# Altium schematic sheet USB to UART0 interface.SchDoc
size A3; SheetNumber: 2; SheetTotal: 9
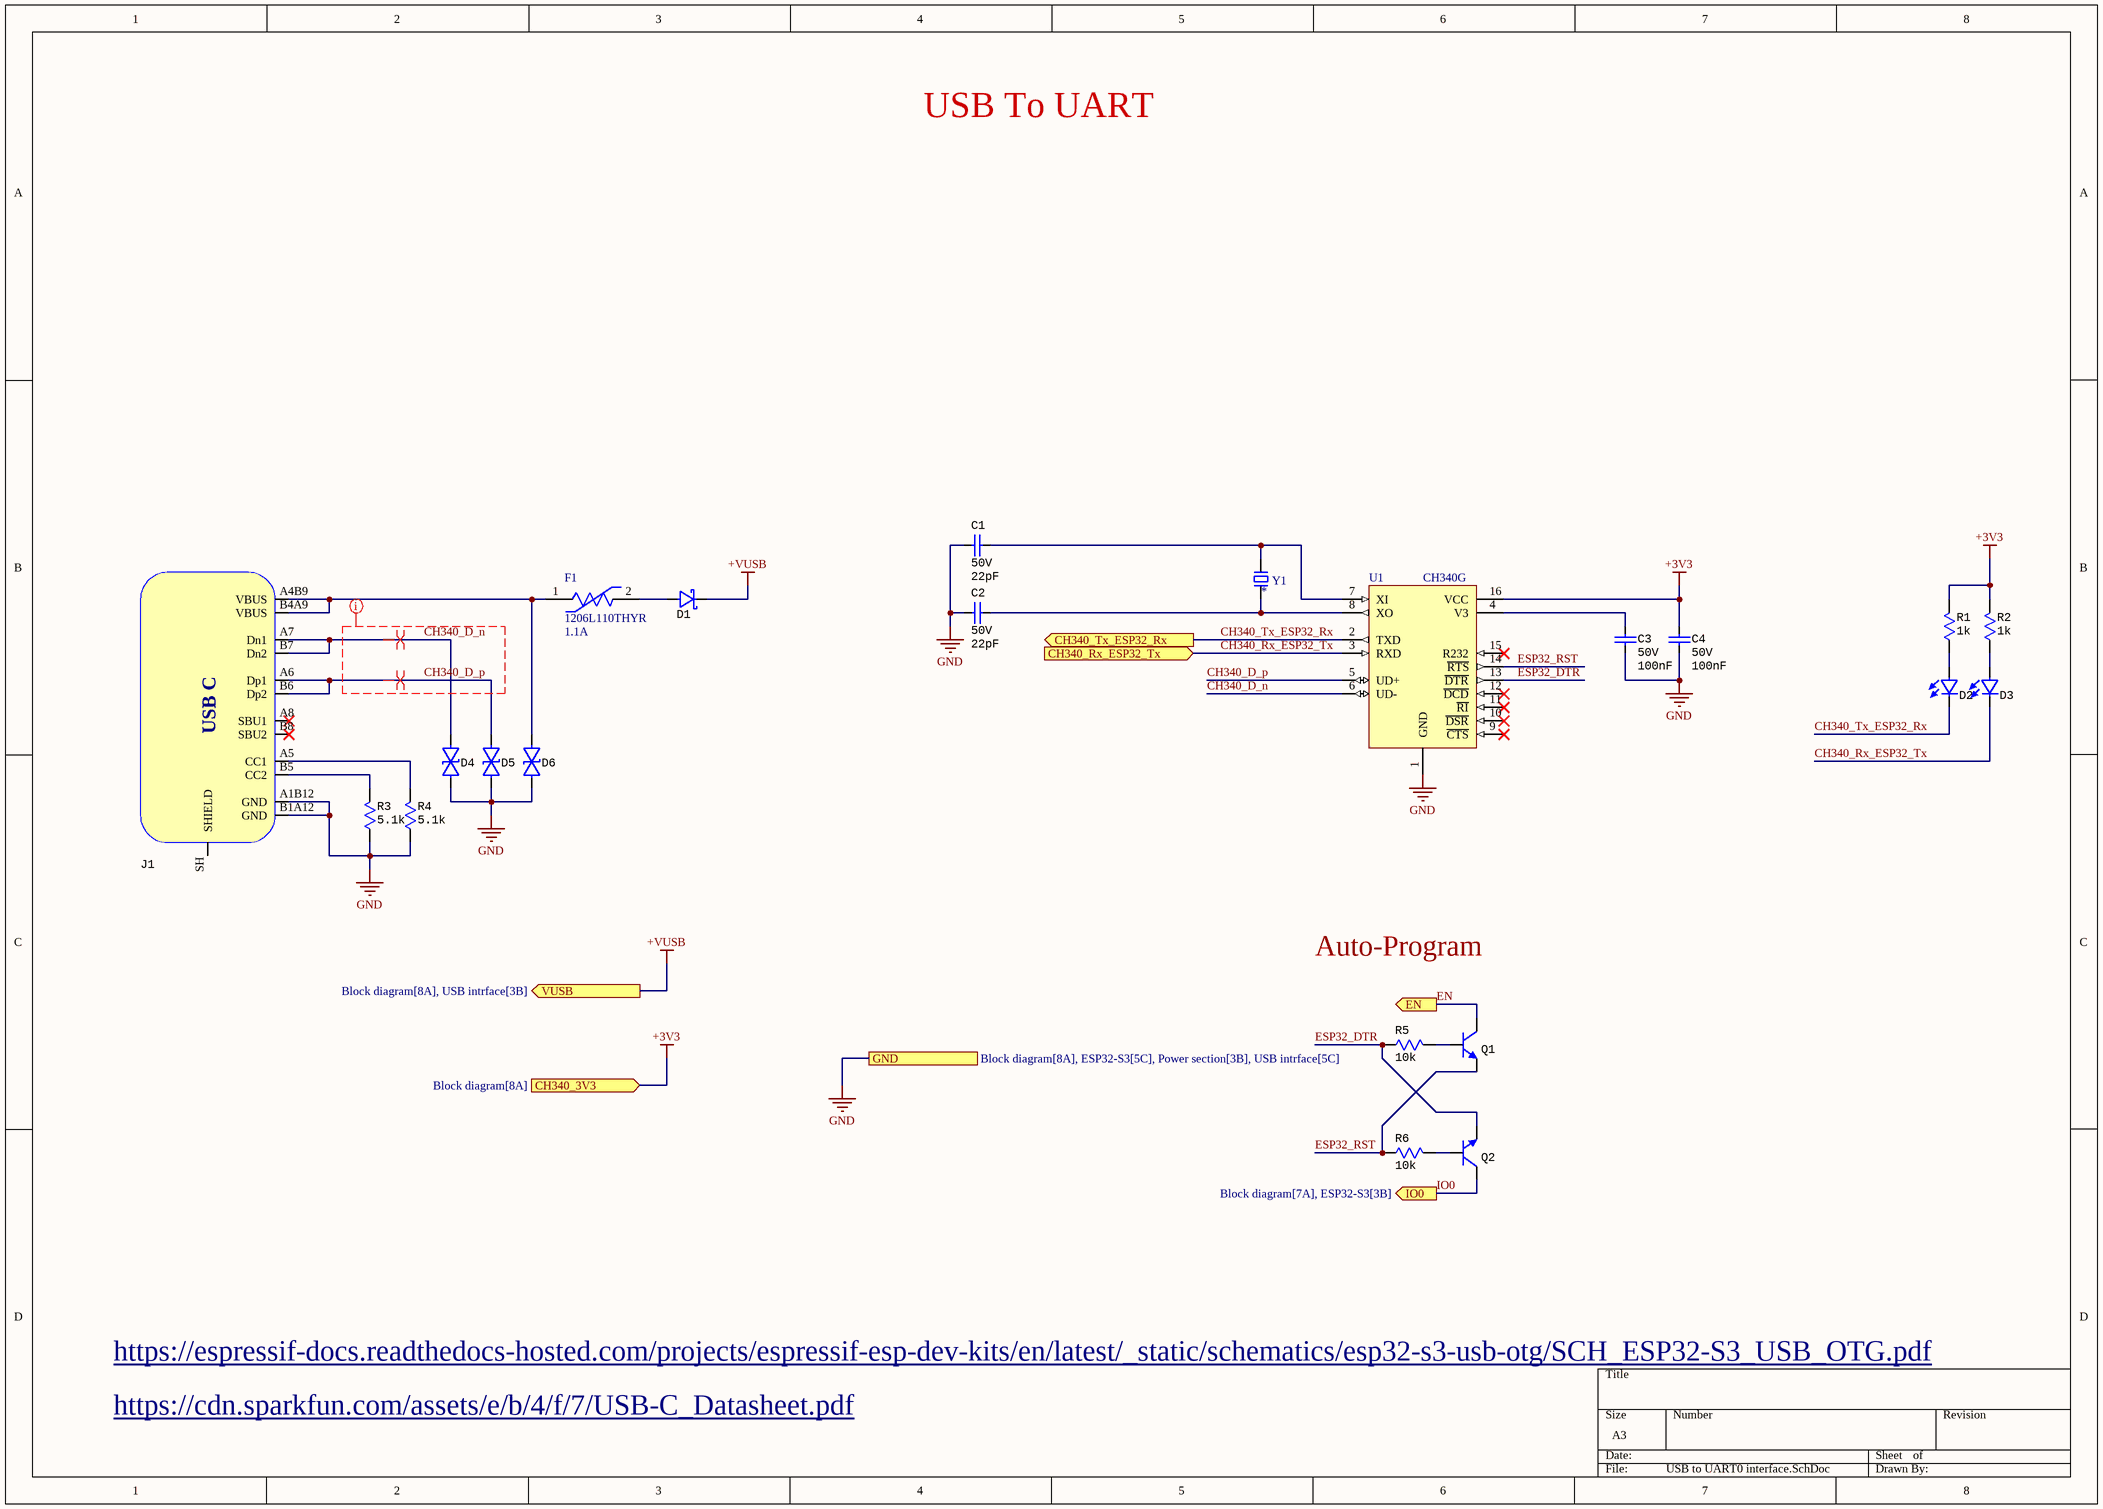
[diagram p0: USB to UART0 interface.SchDoc]

## Parts
C1  Voltage: 50V  [CAP Ceramic SMD 0603]  (hidden comment: 22pF)
C2  Voltage: 50V  [CAP Ceramic SMD 0603]  (hidden comment: 22pF)
C3  Voltage: 50V  [CAP Ceramic SMD 0603]  (hidden comment: 100nF)
C4  Voltage: 50V  [CAP Ceramic SMD 0603]  (hidden comment: 100nF)
D1  (no value)  [Diode Single SMD SOD123]
D2  (no value)  [LED SMD 0805G]
D3  (no value)  [LED SMD 0805G]
D4  (no value)  [Diode Single SMD SOD523]
D5  (no value)  [Diode Single SMD SOD523]
D6  (no value)  [Diode Single SMD SOD523]
F1  1206L110THYR  Hold Current: 1.1A  [FUSE-1206]
J1  Connector_USB_Type_C_12Pin  [USB-C-31-M-12 (12PIN)]  (value not drawn)
Q1  (no value)  [SOT23]
Q2  (no value)  [SOT23]
R1  value 1k  [RES SMD 0603]  (hidden comment: 1kR)
R2  value 1k  [RES SMD 0603]  (hidden comment: 1kR)
R3  value 5.1k  [RES SMD 0603]  (hidden comment: 5.1kR)
R4  value 5.1k  [RES SMD 0603]  (hidden comment: 5.1kR)
R5  value 10k  [RES SMD 0603]  (hidden comment: 10kR)
R6  value 10k  [RES SMD 0603]  (hidden comment: 10kR)
U1  CH340G  [CH340G]
Y1  X49SD8MSD2SC  [Crystal TH 2-PIN HC-49S]  (value not drawn)

## Ports
CH340_3V3 (in, see Block diagram[8A]), CH340_Rx_ESP32_Tx (in, see Block diagram[7A], ESP32-S3[3B]), CH340_Tx_ESP32_Rx (out, see Block diagram[7A], ESP32-S3[3A]), EN (out, see Block diagram[7A], ESP32-S3[3A]), GND (see Block diagram[8A], ESP32-S3[5C], Power section[3B], USB intrface[5C]), IO0 (out, see Block diagram[7A], ESP32-S3[3B]), VUSB (out, see Block diagram[8A], USB intrface[3B])

## Nets
+3V3: C4.1 R1.2 R2.2 U1.16(VCC) ; port CH340_3V3
+VUSB: D1.2 ; port VUSB
GND: C1.1 C2.2 C3.2 C4.2 D4.1 D5.1 D6.1 J1.A1B12(GND) J1.B1A12(GND) R3.1 R4.1 U1.1(GND) ; port GND
CH340_D_n: D4.2 J1.A7(Dn1) J1.B7(Dn2) U1.6(UD-)
CH340_D_p: D5.2 J1.A6(Dp1) J1.B6(Dp2) U1.5(UD+)
CH340_Rx_ESP32_Tx: D3.2 U1.3(RXD) ; port CH340_Rx_ESP32_Tx
CH340_Tx_ESP32_Rx: D2.2 U1.2(TXD) ; port CH340_Tx_ESP32_Rx
EN: Q1.3(C) ; port EN
ESP32_DTR: Q2.2(E) R5.1 U1.13(~{DTR})
ESP32_RST: Q1.2(E) R6.1 U1.14(~{RTS})
IO0: Q2.3(C) ; port IO0
NetC1_2: C1.2 U1.7(XI) Y1.1
NetC2_1: C2.1 U1.8(XO) Y1.2
NetC3_1: C3.1 U1.4(V3)
NetD1_1: D1.1 F1.2
NetD2_1: D2.1 R1.1
NetD3_1: D3.1 R2.1
NetD6_2: D6.2 F1.1 J1.A4B9(VBUS) J1.B4A9(VBUS)
NetJ1_A5: J1.A5(CC1) R4.2
NetJ1_B5: J1.B5(CC2) R3.2
NetQ1_1: Q1.1(B) R5.2
NetQ2_1: Q2.1(B) R6.2

Not connected (* = marked no-connect by the designer): J1 A8(SBU1)* B8(SBU2)* SH(SHIELD); U1 9(~{CTS})* 10(~{DSR})* 11(~{RI})* 12(~{DCD})* 15(R232)*

## Layout directives
net class Diff90Ohm: CH340_D_n, CH340_D_p
differential pair: CH340_D_n, CH340_D_p

## Notes on the sheet
- USB To UART
- Auto-Program
- https://espressif-docs.readthedocs-hosted.com/projects/espressif-esp-dev-kits/en/latest/_static/schematics/esp32-s3-usb-otg/SCH_ESP32-S3_USB_OTG.pdf
- https://cdn.sparkfun.com/assets/e/b/4/f/7/USB-C_Datasheet.pdf
- (in symbol Connector_USB_Type_C_12Pin) USB C

## Library data of the parts
C1 C2 = CAP 0603 22pF 50V: CAP CER 22PF 50V C0G/NP0 0603; Manufacturer: Samsung; Manufacturer Part Number: CL10C220JB81PNC; Tolerance: 5%; Dielectric: C0G; Temperature Coefficient: 300ppm/°C; ComponentLink1URL: https://datasheet.ciiva.com/6293/tdkmlcccaprange-6293701.pdf?src-supplier=Digi-Key; ComponentLink1Description: https://datasheet.ciiva.com/6293/tdkmlcccaprange-6293701.pdf?src-supplier=Digi-Key; ComponentLink2URL: https://datasheet.ciiva.com/22694/1796654-22694102.pdf?src-supplier=Element14; ComponentLink2Description: https://datasheet.ciiva.com/22694/1796654-22694102.pdf?src-supplier=Element14; ComponentLink3URL: https://datasheet.ciiva.com/6293/tdkmlcccaprange-6293704.pdf?src-supplier=Digi-Key; ComponentLink3Description: https://datasheet.ciiva.com/6293/tdkmlcccaprange-6293704.pdf?src-supplier=Digi-Key; ComponentLink4URL: https://datasheet.ciiva.com/28576/1744655-28576921.pdf?src-supplier=Element14; ComponentLink4Description: https://datasheet.ciiva.com/28576/1744655-28576921.pdf?src-supplier=Element14; ComponentLink5URL: https://datasheet.ciiva.com/7975/1796654-7975034.pdf?src-supplier=Element14; ComponentLink5Description: https://datasheet.ciiva.com/7975/1796654-7975034.pdf?src-supplier=Element14; ComponentLink6URL: https://datasheet.ciiva.com/26946/getdatasheetpartid-741952-26946507.pdf?src-supplier=Verical; ComponentLink6Description: https://datasheet.ciiva.com/26946/getdatasheetpartid-741952-26946507.pdf?src-supplier=Verical; ComponentLink7URL: https://datasheet.ciiva.com/6293/tdkmlcccaprange-6293708.pdf?src-supplier=Digi-Key; ComponentLink7Description: https://datasheet.ciiva.com/6293/tdkmlcccaprange-6293708.pdf?src-supplier=Digi-Key; ComponentLink8URL: https://datasheet.ciiva.com/16395/cl10c220jb81pnc-16395896.pdf?src-supplier=Future+Electronics; ComponentLink8Description: https://datasheet.ciiva.com/16395/cl10c220jb81pnc-16395896.pdf?src-supplier=Future+Electronics; ComponentLink9URL: https://datasheet.ciiva.com/15195/getdatasheetpartid-500209-15195809.pdf?src-supplier=Verical; ComponentLink9Description: https://datasheet.ciiva.com/15195/getdatasheetpartid-500209-15195809.pdf?src-supplier=Verical; Supplier 1: LCSC; RoHS: Yes; Category: Ceramic Capacitors; Stock 1: 8800; Pricing 1: 50=0.02060, 500=0.01690, 1500=0.01410, 5000=0.01190, 25000=0.01150, 50000=0.01130 (USD); Mount: Surface Mount; Case/Package: 0603; Case Code (Metric): 1608; Case Code (Imperial): 0603; Min Operating Temperature: -55°C; Max Operating Temperature: 125°C; Package Quantity: 1; Packaging: Tape and Reel; Capacitance: 22pF; Voltage Rating: 50V; Series: CL; Length: 1.6mm; Width: 0.031inch; Height: 0.8mm; Depth: 0.8mm; Thickness: 0.035inch; Ratings: AEC-Q200; Radiation Hardening: No; RoHS Compliant: Yes; Lead Free: Lead Free; Supplier Part Number 1: C170132; Supplier 2: LCSC; Supplier Part Number 2: C1653; Value: 22pF
C3 C4 = CAP 0603 100nF 50V: Multilayer Ceramic Capacitors MLCC Surface Mount 0603 0.1uF 50 Volts X7R 10%; Manufacturer: Murata; Manufacturer Part Number: GRM188R71H104KA93D; Insulation Resistance: 10GR; Supplier 1: LCSC; RoHS: Yes; Category: Ceramic Capacitors; Stock 1: 3546650; Pricing 1: 50=0.00420, 500=0.00330, 1500=0.00290, 5000=0.00260, 25000=0.00250, 50000=0.00240 (USD); Mount: Surface Mount; Case/Package: 0603; Number of Pins: 2; Case Code (Imperial): 0603; Case Code (Metric): 1608; Dielectric Material: Ceramic; Material: Ceramic; Contact Plating: Tin,Matte; Min Operating Temperature: -55°C; Max Operating Temperature: 125°C; Capacitance: 100nF; Tolerance: 10%; Packaging: Tape and Reel; Dielectric: X7R; Voltage Rating (DC): 50V; Termination: SMD/SMT; Package Quantity: 1; Voltage Rating: 50V; Length: 1.6mm; Width: 0.8mm; Height: 0.8mm; Depth: 0.8mm; Thickness: 0.035inch; Radiation Hardening: No; RoHS Compliant: Yes; REACH SVHC: No SVHC; Lead Free: Lead Free; ComponentLink1URL: https://datasheet.ciiva.com/19467/1857604-19467681.pdf?src-supplier=Jameco; ComponentLink1Description: https://datasheet.ciiva.com/19467/1857604-19467681.pdf?src-supplier=Jameco; ComponentLink2URL: https://datasheet.ciiva.com/11786/0900766b807a1cab-11786047.pdf?src-supplier=RSComponents; ComponentLink2Description: https://datasheet.ciiva.com/11786/0900766b807a1cab-11786047.pdf?src-supplier=RSComponents; ComponentLink3URL: https://datasheet.ciiva.com/29201/451744-da-01-en-vs-kondensator-0603-29201904.pdf?src-supplier=Conrad; ComponentLink3Description: https://datasheet.ciiva.com/29201/451744-da-01-en-vs-kondensator-0603-29201904.pdf?src-supplier=Conrad; ComponentLink4URL: https://datasheet.ciiva.com/7937/4360-7937659.pdf?src-supplier=Element14; ComponentLink4Description: https://datasheet.ciiva.com/7937/4360-7937659.pdf?src-supplier=Element14; ComponentLink5URL: https://datasheet.ciiva.com/14116/nmgrm-data-en-14116602.pdf?src-supplier=Distrelec; ComponentLink5Description: https://datasheet.ciiva.com/14116/nmgrm-data-en-14116602.pdf?src-supplier=Distrelec; ComponentLink6URL: https://datasheet.ciiva.com/48436/nmgrm-data-en-48436667.pdf?src-supplier=Distrelec; ComponentLink6Description: https://datasheet.ciiva.com/48436/nmgrm-data-en-48436667.pdf?src-supplier=Distrelec; ComponentLink7URL: https://datasheet.ciiva.com/28534/4360-28534245.pdf?src-supplier=Element14; ComponentLink7Description: https://datasheet.ciiva.com/28534/4360-28534245.pdf?src-supplier=Element14; ComponentLink8URL: https://datasheet.ciiva.com/131/partnumbering-e-01-131739.pdf?src-supplier=Digi-Key; ComponentLink8Description: https://datasheet.ciiva.com/131/partnumbering-e-01-131739.pdf?src-supplier=Digi-Key; ComponentLink9URL: https://datasheet.ciiva.com/131/partnumbering-e-01-131738.pdf?src-supplier=Digi-Key; ComponentLink9Description: https://datasheet.ciiva.com/131/partnumbering-e-01-131738.pdf?src-supplier=Digi-Key; ComponentLink10URL: https://datasheet.ciiva.com/131/partnumbering-e-01-131740.pdf?src-supplier=Digi-Key; ComponentLink10Description: https://datasheet.ciiva.com/131/partnumbering-e-01-131740.pdf?src-supplier=Digi-Key; ComponentLink11URL: https://datasheet.ciiva.com/7937/1747470-7937658.pdf?src-supplier=Element14; ComponentLink11Description: https://datasheet.ciiva.com/7937/1747470-7937658.pdf?src-supplier=Element14; Supplier Part Number 1: C77055; Value: 100nF
D1 = B5819W: 40V 600mV@1A 1A SOD-123 Schottky Barrier Diodes (SBD) ROHS; Manufacturer: MCC; Manufacturer Part Number: B5819W-TP; Element Configuration: Single; Forward Voltage: 550mV; Max Reverse Voltage (DC): 20V; Max Forward Surge Current (Ifsm): 10A; Max Reverse Current: 1mA; Max Power Dissipation: 250mW; Supplier 1: LCSC; RoHS: Yes; Category: Rectifier Diodes; Stock 1: 8570; Pricing 1: 10=0.04150, 100=0.03440, 300=0.03090, 3000=0.02820, 6000=0.02610, 9000=0.02500 (USD); Mount: Surface Mount; Min Operating Temperature: -65°C; Max Operating Temperature: 125°C; Package Quantity: 3000; Packaging: Tape and Reel; Average Rectified Current: 1A; Series: -; Reverse Voltage (DC): 40V; Forward Current: 1A; Max Repetitive Reverse Voltage (Vrrm): 40V; RoHS Compliant: Yes; ComponentLink1URL: https://datasheet.ciiva.com/6378/b5817w-b5819wsod-123-6378255.pdf?src-supplier=Digi-Key; ComponentLink1Description: https://datasheet.ciiva.com/6378/b5817w-b5819wsod-123-6378255.pdf?src-supplier=Digi-Key; Supplier Part Number 1: C84354
D2 D3 = LED 0805 Emerald: Manufacturer: FOSHAN Nationstar Optoelectronics; Manufacturer Part Number: NCD0805G1; Supplier 1: LCSC; Supplier Part Number 1: C84260; RoHS: No; Category: Uncategorized; Stock 1: 432460; Pricing 1: 20=0.01910, 200=0.01510, 600=0.01290, 3000=0.01160, 9000=0.01050, 21000=0.00990 (USD)
D4-D6 = LESD5D5.0CT1G: Bi-Directional 9.4A 5V 18.6V 5.6V SOD-523 ESD Protection Devices ROHS; Manufacturer: UMW(Youtai Semiconductor); Supplier 1: LCSC; Manufacturer Part Number: LESD5D5.0CT1G; RoHS: No; Category: Uncategorized; Stock 1: 13940; Pricing 1: 20=0.02140, 200=0.01710, 600=0.01470, 3000=0.01330, 9000=0.01330, 21000=0.01330 (USD); Supplier Part Number 1: C5199850
F1 = 1206L110THYR: PTC RESET FUSE 8V 1.1A 1206; Manufacturer: Littelfuse; Trip Time: 0.1s; Trip Current: 2.2A; Value: 0.04-0.21Ω; Current Rating: 100A; Voltage Rating: 8V; Device Class L3: unset; Manufacturer Part Number: 1206L110THYR; ComponentLink2URL: https://m.littelfuse.com/~/media/electronics/datasheets/resettable_ptcs/littelfuse_ptc_1206l_datasheet.pdf.pdf; Height: 0.6mm; Temperature Range Low: -40°C; Automotive: No; Device Class L2: PTC Resettable Fuses; Device Class L1: Circuit Protection; Digikey Description: PTC RESET FUSE 8V 1.1A 1206; Octopart: https://octopart.com/1206l110thyr-littelfuse-11800142; Temperature Range High: +85°C; Category: Fuse; RoHS: TRUE; Ambient Temperature Range Low: -40°C; Mouser Description: Resettable Fuses - PPTC PTC 8V 1206 1.1A POLYFUSE SMD THIN; ComponentLink2Description: Datasheet; Ambient Temperature Range High: +85°C; Lead Free: Yes; Resistance: 0.04-0.21Ω; Temperature: -40°C to +85°C; Package: 1206L
J1 = Connector_USB_Type_C_12Pin: Korean Hroparts Elec / USB-Type-C / Num of contacts 16 / Surface Mount; ManufacturerPartNumber: TYPE-C-31-M-12; SuplierPartNumber: C165948; TypeConnector: USB Type C; CurrentMax: 3A; Manufacturer: Korean Hroparts; HelpURL: https://lcsc.com/product-detail/USB-Type-C_Korean-Hroparts-Elec-TYPE-C-31-M-12_C165948.html
Q1 Q2 = BC817: NPN Ic=500mA Vceo=45V hfe=100~250 P=225mW SOT-23; Manufacturer: ON Semiconductor; Manufacturer Part Number: BC817-16LT1G; Collector Emitter Voltage (VCEO): 45V; Max Power Dissipation: 300mW; Max Collector Current: 500mA; Collector Base Voltage (VCBO): 50V; Emitter Base Voltage (VEBO): 5V; Collector Emitter Saturation Voltage: 700mV; Max Frequency: 100MHz; Element Configuration: Single; Number of Elements: 1; hFE Min: 100; Output Voltage: 15V; Supplier 1: LCSC; RoHS: Yes; Category: BJTs; Stock 1: 1880; Pricing 1: 10=0.03790, 100=0.03090, 300=0.02740, 3000=0.02460, 6000=0.02250, 9000=0.02140 (USD); Case/Package: SOT-23-3; Number of Pins: 3; Contact Plating: Tin,Matte; Weight: 0.001058oz; Min Operating Temperature: -55°C; Max Operating Temperature: 150°C; Packaging: Tape and Reel; Polarity: NPN; Power Dissipation: 300mW; Package Quantity: 3000; Frequency: 100MHz; Transition Frequency: 100MHz; Collector Emitter Breakdown Voltage: 45V; Max Breakdown Voltage: 45V; Gain Bandwidth Product: 100MHz; Collector-emitter Voltage-Max: 700mV; Series: -; Current Rating: 500mA; Voltage Rating (DC): 45V; Continuous Collector Current: 500mA; Length: 2.9mm; Width: 1.3mm; Height: 0.94mm; Radiation Hardening: No; RoHS Compliant: Yes; Lead Free: Lead Free; Reach SVHC Compliant: Yes; Halogen Free: Halogen Free; Supplier Part Number 1: C94373
R1 R2 = RES 0603 1k 1%: Res Thick Film 0603 1K Ohm 1% 1/10W ±100ppm/°C Molded SMD Punched Carrier T/R; Manufacturer: Panasonic; Manufacturer Part Number: ERJ3EKF1001V; Power Rating: 100mW; Voltage Rating: 75V; Supplier 1: LCSC; RoHS: Yes; Category: Chip SMD Resistors; Stock 1: 79650; Pricing 1: 50=0.009600, 500=0.008100, 1500=0.007300, 5000=0.006800, 25000=0.006400, 50000=0.006200 (AUD); Mount: Surface Mount; Case/Package: 0603; Number of Pins: 2; Case Code (Metric): 1608; Case Code (Imperial): 0603; Contact Plating: Tin; Size Code: 0603; Min Operating Temperature: -55°C; Max Operating Temperature: 155°C; Packaging: Tape and Reel; Resistance: 1kR; Resistor Type: Thick Film; Temperature Coefficient: 100ppm/°C; Series: ERJ; Tolerance: 1%; Number of Terminations: 2; Max Power Dissipation: 100mW; Construction: Rectangular; Features: Automotive AEC-Q200; Package Quantity: 5000; Termination: SMD/SMT; Voltage Rating (DC): 75V; Resistance Tolerance: 1%; Technology: THICK FILM; Length: 1.6mm; Width: 0.8mm; Height: 0.45mm; Depth: 0.8mm; Radiation Hardening: No; RoHS Compliant: Yes; Lead Free: Lead Free; Military Standard: Not; REACH SVHC: No SVHC; ComponentLink1URL: https://datasheet.ciiva.com/7942/aoa0000ce2-7942427.pdf?src-supplier=Element14; ComponentLink1Description: https://datasheet.ciiva.com/7942/aoa0000ce2-7942427.pdf?src-supplier=Element14; ComponentLink2URL: https://datasheet.ciiva.com/46373/1678782-46373340.pdf?src-supplier=Element14; ComponentLink2Description: https://datasheet.ciiva.com/46373/1678782-46373340.pdf?src-supplier=Element14; ComponentLink3URL: https://datasheet.ciiva.com/22673/1678782-22673918.pdf?src-supplier=Element14; ComponentLink3Description: https://datasheet.ciiva.com/22673/1678782-22673918.pdf?src-supplier=Element14; ComponentLink4URL: https://datasheet.ciiva.com/46373/1678782-46373339.pdf?src-supplier=Element14; ComponentLink4Description: https://datasheet.ciiva.com/46373/1678782-46373339.pdf?src-supplier=Element14; ComponentLink5URL: https://datasheet.ciiva.com/24070/aoa0000ce2-24070269.pdf?src-supplier=Mouser; ComponentLink5Description: https://datasheet.ciiva.com/24070/aoa0000ce2-24070269.pdf?src-supplier=Mouser; ComponentLink6URL: https://datasheet.ciiva.com/16768/70260748-16768437.pdf?src-supplier=Allied+Electronics; ComponentLink6Description: https://datasheet.ciiva.com/16768/70260748-16768437.pdf?src-supplier=Allied+Electronics; ComponentLink7URL: https://datasheet.ciiva.com/16774/70260748-16774550.pdf?src-supplier=Allied+Electronics; ComponentLink7Description: https://datasheet.ciiva.com/16774/70260748-16774550.pdf?src-supplier=Allied+Electronics; ComponentLink8URL: https://datasheet.ciiva.com/9198/aoa0000ce2-9198923.pdf?src-supplier=Avnet; ComponentLink8Description: https://datasheet.ciiva.com/9198/aoa0000ce2-9198923.pdf?src-supplier=Avnet; ComponentLink9URL: https://datasheet.ciiva.com/16449/aoa0000ce2-16449065.pdf?src-supplier=Future+Electronics; ComponentLink9Description: https://datasheet.ciiva.com/16449/aoa0000ce2-16449065.pdf?src-supplier=Future+Electronics; ComponentLink10URL: https://datasheet.ciiva.com/48530/aoa0000ce2-48530987.pdf?src-supplier=Avnet; ComponentLink10Description: https://datasheet.ciiva.com/48530/aoa0000ce2-48530987.pdf?src-supplier=Avnet; ComponentLink11URL: https://datasheet.ciiva.com/30063/aoa0000ce2-30063390.pdf?src-supplier=Onlinecomponents.com; ComponentLink11Description: https://datasheet.ciiva.com/30063/aoa0000ce2-30063390.pdf?src-supplier=Onlinecomponents.com; Supplier Part Number 1: C118155
R3 R4 = RES 0603 5.1k 1%: Res Thick Film 0603 5.1K Ohm 1% 1/10W ±100ppm/°C Molded SMD SMD Paper T/R; Manufacturer: Vishay; Manufacturer Part Number: CRCW06035K10FKEA; Max Power Dissipation: 100mW; Voltage Rating (DC): 75V; Supplier 1: LCSC; RoHS: Yes; Category: Chip SMD Resistors; Stock 1: 3800; Pricing 1: 50=0.017200, 500=0.013100, 1500=0.011300, 5000=0.010700, 25000=0.009300, 50000=0.009200 (AUD); Mount: Surface Mount; Case/Package: 0603; Case Code (Imperial): 0603; Case Code (Metric): 1608; Contact Plating: Tin; Size Code: 0603; Weight: 7.1E-05oz; Min Operating Temperature: -55°C; Max Operating Temperature: 155°C; Packaging: Tape and Reel; Resistance: 5.1kR; Tolerance: 1%; Temperature Coefficient: 100ppm/°C; Resistor Type: Thick Film; Series: CRCW; Number of Terminations: 2; Package Quantity: 5000; Power Rating: 100mW; Voltage Rating: 75V; Construction: Rectangular; Features: Automotive AEC-Q200; Termination: SMD/SMT; Resistance Tolerance: 1%; Technology: THICK FILM; Length: 1.55mm; Width: 0.85mm; Height: 0.45mm; Depth: 0.85mm; Radiation Hardening: No; RoHS Compliant: Yes; Lead Free: Lead Free; Military Standard: Not; REACH SVHC: Unknown; ComponentLink1URL: https://datasheet.ciiva.com/11809/0900766b80d98afc-11809935.pdf?src-supplier=RSComponents; ComponentLink1Description: https://datasheet.ciiva.com/11809/0900766b80d98afc-11809935.pdf?src-supplier=RSComponents; ComponentLink2URL: https://datasheet.ciiva.com/26314/fld-crcw-e3-data-en-26314742.pdf?src-supplier=Distrelec; ComponentLink2Description: https://datasheet.ciiva.com/26314/fld-crcw-e3-data-en-26314742.pdf?src-supplier=Distrelec; ComponentLink3URL: https://datasheet.ciiva.com/7690/1697337-7690728.pdf?src-supplier=Element14; ComponentLink3Description: https://datasheet.ciiva.com/7690/1697337-7690728.pdf?src-supplier=Element14; ComponentLink4URL: https://datasheet.ciiva.com/7690/1720486-7690873.pdf?src-supplier=Element14; ComponentLink4Description: https://datasheet.ciiva.com/7690/1720486-7690873.pdf?src-supplier=Element14; ComponentLink5URL: https://datasheet.ciiva.com/15159/getdatasheetpartid-32793-15159338.pdf?src-supplier=Verical; ComponentLink5Description: https://datasheet.ciiva.com/15159/getdatasheetpartid-32793-15159338.pdf?src-supplier=Verical; ComponentLink6URL: https://datasheet.ciiva.com/3257/dcrcwe3-3257758.pdf?src-supplier=Avnet; ComponentLink6Description: https://datasheet.ciiva.com/3257/dcrcwe3-3257758.pdf?src-supplier=Avnet; ComponentLink7URL: https://datasheet.ciiva.com/16226/dcrcwe3-16226862.pdf?src-supplier=Future+Electronics; ComponentLink7Description: https://datasheet.ciiva.com/16226/dcrcwe3-16226862.pdf?src-supplier=Future+Electronics; Supplier Part Number 1: C844933
R5 R6 = RES 0603 10k 1%: Res Thick Film 0603 10K Ohm 1% 1/10W ±100ppm/°C Molded SMD Punched Carrier T/R; Manufacturer: Panasonic; Manufacturer Part Number: ERJ-3EKF1002V; Max Power Dissipation: 100mW; Voltage Rating: 75V; Supplier 1: LCSC; RoHS: Yes; Category: Chip SMD Resistors; Stock 1: 555600; Pricing 1: 50=0.010200, 500=0.008400, 1500=0.007300, 5000=0.006100, 25000=0.005500, 50000=0.005400 (AUD); Mount: Surface Mount; Case/Package: 0603; Number of Pins: 2; Case Code (Metric): 1608; Case Code (Imperial): 0603; Contact Plating: Tin; Size Code: 0603; Min Operating Temperature: -55°C; Max Operating Temperature: 155°C; Resistance: 10kR; Packaging: Tape and Reel; Resistor Type: Thick Film; Temperature Coefficient: 100ppm/°C; Tolerance: 1%; Number of Terminations: 2; Series: ERJ; Construction: Rectangular; Power Rating: 100mW; Features: Automotive AEC-Q200; Voltage Rating (DC): 75V; Package Quantity: 1; Resistance Tolerance: 1%; Termination: SMD/SMT; Technology: THICK FILM; Length: 1.6mm; Width: 0.031inch; Height: 0.45mm; Depth: 0.8mm; Radiation Hardening: No; RoHS Compliant: Yes; Military Standard: Not; Lead Free: Lead Free; REACH SVHC: No SVHC; ComponentLink1URL: https://datasheet.ciiva.com/7830/aoa0000ce2-7830729.pdf?src-supplier=Element14; ComponentLink1Description: https://datasheet.ciiva.com/7830/aoa0000ce2-7830729.pdf?src-supplier=Element14; ComponentLink2URL: https://datasheet.ciiva.com/46372/1678782-46372725.pdf?src-supplier=Element14; ComponentLink2Description: https://datasheet.ciiva.com/46372/1678782-46372725.pdf?src-supplier=Element14; ComponentLink3URL: https://datasheet.ciiva.com/28514/426256-28514198.pdf?src-supplier=Element14; ComponentLink3Description: https://datasheet.ciiva.com/28514/426256-28514198.pdf?src-supplier=Element14; ComponentLink4URL: https://datasheet.ciiva.com/24070/aoa0000ce2-24070318.pdf?src-supplier=Mouser; ComponentLink4Description: https://datasheet.ciiva.com/24070/aoa0000ce2-24070318.pdf?src-supplier=Mouser; ComponentLink5URL: https://datasheet.ciiva.com/16759/70260748-16759807.pdf?src-supplier=Allied+Electronics; ComponentLink5Description: https://datasheet.ciiva.com/16759/70260748-16759807.pdf?src-supplier=Allied+Electronics; ComponentLink6URL: https://datasheet.ciiva.com/9194/aoa0000ce2-9194199.pdf?src-supplier=Avnet; ComponentLink6Description: https://datasheet.ciiva.com/9194/aoa0000ce2-9194199.pdf?src-supplier=Avnet; ComponentLink7URL: https://datasheet.ciiva.com/48530/aoa0000ce2-48530988.pdf?src-supplier=Avnet; ComponentLink7Description: https://datasheet.ciiva.com/48530/aoa0000ce2-48530988.pdf?src-supplier=Avnet; ComponentLink8URL: https://datasheet.ciiva.com/30208/aoa0000ce2-30208985.pdf?src-supplier=Onlinecomponents.com; ComponentLink8Description: https://datasheet.ciiva.com/30208/aoa0000ce2-30208985.pdf?src-supplier=Onlinecomponents.com; Supplier Part Number 1: C191124
U1 = CH340G: Transceiver 2Mbps USB 2.0 SOP-16-150mil USB ICs ROHS; Manufacturer: WCH(Jiangsu Qin Heng); Part Numbr: CH340G; Supplier: LCSC; Supplier Part Number: C14267; ComponentLink1Description: link; ComponentLink1URL: https://www.lcsc.com/product-detail/USB-ICs_WCH-Jiangsu-Qin-Heng-CH340G_C14267.html
Y1 = X49SD8MSD2SC: 8MHz 49S Crystals 20pF ±20ppm ±30ppm -20℃~+70℃ HC-49S Crystals ROHS; Part Number: *; Manufacturer: *; Supplier: *; Supplier Part Number: *; Value: *; Supplier 1: LCSC; Supplier Part Number 1: C21263; Manufacturer Part Number: X49SD8MSD2SC; RoHS: No; Stock 1: 118995; Pricing 1: 5=0.07050, 50=0.05680, 150=0.04990, 500=0.04480, 2500=0.04070, 5000=0.03870 (USD)